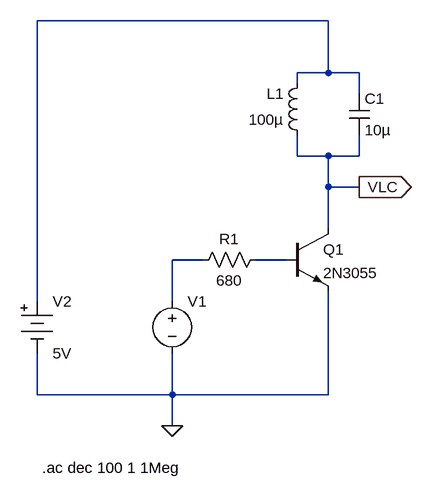
[diagram p0: schematic PLC-with-TransistorAC.asc]
PLC-with-TransistorAC.asc, the LTspice schematic file:
Version 4
SHEET 1 880 736
WIRE 592 32 144 32
WIRE 592 112 592 32
WIRE 592 112 544 112
WIRE 640 112 592 112
WIRE 544 128 544 112
WIRE 640 144 640 112
WIRE 544 240 544 208
WIRE 592 240 544 240
WIRE 640 240 640 208
WIRE 640 240 592 240
WIRE 592 288 592 240
WIRE 640 288 592 288
WIRE 592 352 592 288
WIRE 400 400 352 400
WIRE 528 400 480 400
WIRE 144 464 144 32
WIRE 352 464 352 400
WIRE 144 608 144 544
WIRE 352 608 352 544
WIRE 352 608 144 608
WIRE 592 608 592 448
WIRE 592 608 352 608
WIRE 352 656 352 608
FLAG 640 288 VLC
IOPIN 640 288 Out
FLAG 352 656 0
SYMBOL ind 560 224 R180
WINDOW 0 36 80 Left 2
WINDOW 3 36 40 Left 2
SYMATTR InstName L1
SYMATTR Value 100µ
SYMATTR SpiceLine Ipk=1 Rser=85m Rpar=infin. Cpar=0 mfg="Coiltronics" pn="CTX100-1-52"
SYMBOL cap 624 144 R0
SYMATTR InstName C1
SYMATTR Value 10µ
SYMBOL npn 528 352 R0
SYMATTR InstName Q1
SYMATTR Value 2N3055
SYMBOL res 496 384 R90
WINDOW 0 0 56 VBottom 2
WINDOW 3 32 56 VTop 2
SYMATTR InstName R1
SYMATTR Value 680
SYMBOL voltage 352 448 R0
WINDOW 3 24 96 Invisible 2
SYMATTR InstName V1
SYMATTR Value SINE(1.25 0.5 5K)
SYMATTR Value2 AC 0.5 0
SYMBOL Misc/battery 144 448 R0
SYMATTR InstName V2
SYMATTR Value 5V
SYMATTR SpiceLine Rser=3
TEXT 152 720 Left 2 !.ac dec 100 1 1Meg

The netlist it stands for:
* PLC-with-TransistorAC.asc
L1 VLC N001 100µ Ipk=1 Rser=85m Rpar=infin. Cpar=0 mfg="Coiltronics" pn="CTX100-1-52"
C1 N001 VLC 10µ
Q1 VLC N003 0 0 2N3055
R1 N003 N002 680
V1 N002 0 SINE(1.25 0.5 5K) AC 0.5 0
V2 N001 0 5V Rser=3
.model NPN NPN
.model PNP PNP
.lib standard.bjt
.ac dec 100 1 1Meg
.backanno
.end